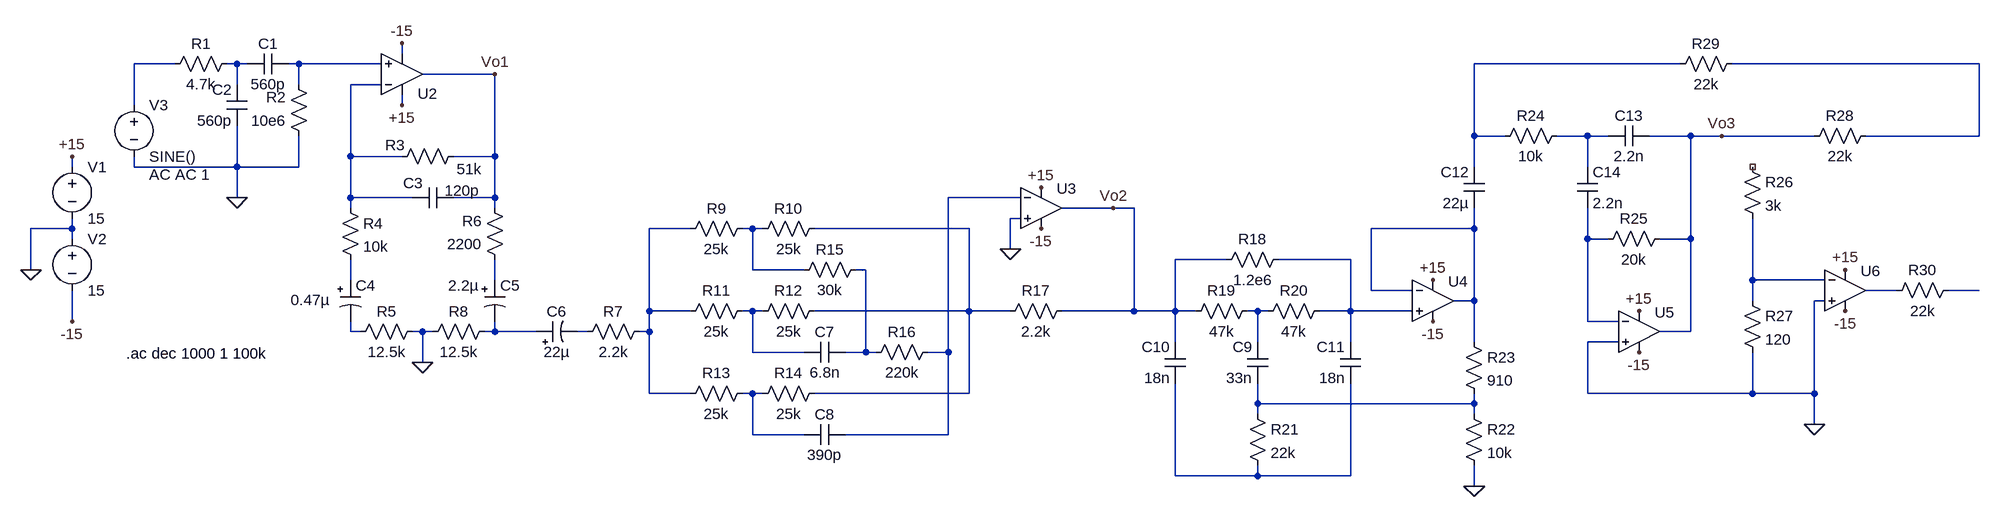
[diagram p0: schematic Amplificador_Jose.asc]
Amplificador_Jose.asc, the LTspice schematic file:
Version 4
SHEET 1 2568 988
WIRE 112 96 112 80
WIRE -240 112 -304 112
WIRE -144 112 -160 112
WIRE -128 112 -144 112
WIRE -48 112 -64 112
WIRE 80 112 -48 112
WIRE 2096 112 1776 112
WIRE 2560 112 2176 112
WIRE 256 128 144 128
WIRE -144 144 -144 112
WIRE -48 144 -48 112
WIRE 80 144 32 144
WIRE -304 176 -304 112
WIRE 112 176 112 160
WIRE 1776 224 1776 112
WIRE 1824 224 1776 224
WIRE 1952 224 1904 224
WIRE 1984 224 1952 224
WIRE 2112 224 2048 224
WIRE 2160 224 2112 224
WIRE 2304 224 2160 224
WIRE 2560 224 2560 112
WIRE 2560 224 2384 224
WIRE 32 256 32 144
WIRE 112 256 32 256
WIRE 256 256 256 128
WIRE 256 256 192 256
WIRE -400 272 -400 256
WIRE -304 272 -304 256
WIRE -144 272 -144 208
WIRE -144 272 -304 272
WIRE -48 272 -48 224
WIRE -48 272 -144 272
WIRE 1776 272 1776 224
WIRE 1952 272 1952 224
WIRE -144 320 -144 272
WIRE 32 320 32 256
WIRE 128 320 32 320
WIRE 256 320 256 256
WIRE 256 320 192 320
WIRE 1072 320 960 320
WIRE 32 336 32 320
WIRE 256 336 256 320
WIRE 1216 336 1136 336
WIRE 1248 336 1216 336
WIRE 1072 352 1056 352
WIRE -400 368 -400 352
WIRE -400 368 -464 368
WIRE 560 368 496 368
WIRE 656 368 640 368
WIRE 672 368 656 368
WIRE 992 368 752 368
WIRE 1776 368 1776 336
WIRE 1776 368 1616 368
WIRE -400 384 -400 368
WIRE 1952 384 1952 336
WIRE 1984 384 1952 384
WIRE 2112 384 2112 224
WIRE 2112 384 2064 384
WIRE 1056 400 1056 352
WIRE 1392 416 1312 416
WIRE 1584 416 1472 416
WIRE -464 432 -464 368
WIRE 656 432 656 368
WIRE 736 432 656 432
WIRE 832 432 816 432
WIRE 32 448 32 416
WIRE 256 448 256 416
WIRE 2208 448 2208 352
WIRE 2320 448 2208 448
WIRE 1616 464 1616 368
WIRE 1680 464 1616 464
WIRE 2432 464 2384 464
WIRE 2560 464 2512 464
WIRE 1776 480 1776 368
WIRE 1776 480 1744 480
WIRE 2208 480 2208 448
WIRE 2320 480 2304 480
WIRE 496 496 496 368
WIRE 560 496 496 496
WIRE 656 496 640 496
WIRE 672 496 656 496
WIRE 992 496 992 368
WIRE 992 496 752 496
WIRE 1056 496 992 496
WIRE 1248 496 1248 336
WIRE 1248 496 1136 496
WIRE 1312 496 1312 416
WIRE 1312 496 1248 496
WIRE 1344 496 1312 496
WIRE 1440 496 1424 496
WIRE 1456 496 1440 496
WIRE 1584 496 1584 416
WIRE 1584 496 1536 496
WIRE 1680 496 1584 496
WIRE -400 512 -400 464
WIRE 1952 512 1952 384
WIRE 2000 512 1952 512
WIRE 32 528 32 512
WIRE 48 528 32 528
WIRE 144 528 128 528
WIRE 160 528 144 528
WIRE 256 528 256 512
WIRE 256 528 240 528
WIRE 320 528 256 528
WIRE 400 528 384 528
WIRE 496 528 496 496
WIRE 496 528 480 528
WIRE 2112 528 2112 384
WIRE 2112 528 2064 528
WIRE 1312 544 1312 496
WIRE 1440 544 1440 496
WIRE 1584 544 1584 496
WIRE 1776 544 1776 480
WIRE 2000 544 1952 544
WIRE 656 560 656 496
WIRE 736 560 656 560
WIRE 832 560 832 432
WIRE 832 560 800 560
WIRE 848 560 832 560
WIRE 960 560 960 320
WIRE 960 560 928 560
WIRE 144 576 144 528
WIRE 496 624 496 528
WIRE 560 624 496 624
WIRE 656 624 640 624
WIRE 672 624 656 624
WIRE 992 624 992 496
WIRE 992 624 752 624
WIRE 1952 624 1952 544
WIRE 2208 624 2208 560
WIRE 2208 624 1952 624
WIRE 2304 624 2304 480
WIRE 2304 624 2208 624
WIRE 1440 640 1440 608
WIRE 1776 640 1776 624
WIRE 1776 640 1440 640
WIRE 1440 656 1440 640
WIRE 1776 656 1776 640
WIRE 2304 672 2304 624
WIRE 656 688 656 624
WIRE 736 688 656 688
WIRE 960 688 960 560
WIRE 960 688 800 688
WIRE 1312 752 1312 608
WIRE 1440 752 1440 736
WIRE 1440 752 1312 752
WIRE 1584 752 1584 608
WIRE 1584 752 1440 752
WIRE 1776 768 1776 736
FLAG 112 176 +15
FLAG -400 256 +15
FLAG -400 512 -15
FLAG 112 80 -15
FLAG -464 432 0
FLAG -144 320 0
FLAG 144 576 0
FLAG 1104 304 +15
FLAG 1104 368 -15
FLAG 1056 400 0
FLAG 256 128 Vo1
FLAG 1216 336 Vo2
FLAG 1712 448 +15
FLAG 1712 512 -15
FLAG 1776 768 0
FLAG 2160 224 Vo3
FLAG 2032 496 +15
FLAG 2032 560 -15
FLAG 2352 432 +15
FLAG 2352 496 -15
FLAG 2304 672 0
SYMBOL voltage -400 256 R0
WINDOW 123 0 0 Left 0
WINDOW 39 0 0 Left 0
SYMATTR InstName V1
SYMATTR Value 15
SYMBOL voltage -400 368 R0
WINDOW 123 0 0 Left 0
WINDOW 39 0 0 Left 0
SYMATTR InstName V2
SYMATTR Value 15
SYMBOL voltage -304 160 R0
WINDOW 123 24 124 Left 2
WINDOW 39 0 0 Left 0
SYMATTR Value2 AC AC 1
SYMATTR InstName V3
SYMATTR Value SINE()
SYMBOL res -144 96 R90
WINDOW 0 0 56 VBottom 2
WINDOW 3 32 56 VTop 2
SYMATTR InstName R1
SYMATTR Value 4.7k
SYMBOL res -32 240 R180
WINDOW 0 36 76 Left 2
WINDOW 3 36 40 Left 2
SYMATTR InstName R2
SYMATTR Value 10e6
SYMBOL res 96 272 R270
WINDOW 0 18 5 VTop 2
WINDOW 3 12 120 VBottom 2
SYMATTR InstName R3
SYMATTR Value 51k
SYMBOL res 16 320 R0
SYMATTR InstName R4
SYMATTR Value 10k
SYMBOL res 272 432 R180
WINDOW 0 36 76 Left 2
WINDOW 3 36 40 Left 2
SYMATTR InstName R6
SYMATTR Value 2200
SYMBOL res 384 544 R270
WINDOW 0 32 56 VTop 2
WINDOW 3 0 56 VBottom 2
SYMATTR InstName R7
SYMATTR Value 2.2k
SYMBOL cap -64 96 R90
WINDOW 0 0 32 VBottom 2
WINDOW 3 32 32 VTop 2
SYMATTR InstName C1
SYMATTR Value 560p
SYMBOL cap -128 208 R180
WINDOW 0 24 56 Left 2
WINDOW 3 24 8 Left 2
SYMATTR InstName C2
SYMATTR Value 560p
SYMBOL cap 128 336 R270
WINDOW 0 23 1 VTop 2
WINDOW 3 43 77 VBottom 2
SYMATTR InstName C3
SYMATTR Value 120p
SYMBOL polcap 16 448 R0
WINDOW 3 -77 31 Left 2
SYMATTR InstName C4
SYMATTR Value 0.47µ
SYMBOL polcap 240 448 R0
WINDOW 3 -56 8 Left 2
SYMATTR InstName C5
SYMATTR Value 2.2µ
SYMBOL polcap 320 544 R270
WINDOW 0 32 32 VTop 2
WINDOW 3 0 32 VBottom 2
SYMATTR InstName C6
SYMATTR Value 22µ
SYMBOL OpAmps\\UniversalOpamp2 112 128 M180
WINDOW 0 24 -30 Left 2
SYMATTR InstName U2
SYMBOL res 144 512 R90
WINDOW 0 0 56 VBottom 2
WINDOW 3 32 56 VTop 2
SYMATTR InstName R5
SYMATTR Value 12.5k
SYMBOL res 256 512 R90
WINDOW 0 0 56 VBottom 2
WINDOW 3 32 56 VTop 2
SYMATTR InstName R8
SYMATTR Value 12.5k
SYMBOL res 656 352 R90
WINDOW 0 0 56 VBottom 2
WINDOW 3 32 56 VTop 2
SYMATTR InstName R9
SYMATTR Value 25k
SYMBOL res 768 352 R90
WINDOW 0 0 56 VBottom 2
WINDOW 3 32 56 VTop 2
SYMATTR InstName R10
SYMATTR Value 25k
SYMBOL res 656 480 R90
WINDOW 0 0 56 VBottom 2
WINDOW 3 32 56 VTop 2
SYMATTR InstName R11
SYMATTR Value 25k
SYMBOL res 768 480 R90
WINDOW 0 0 56 VBottom 2
WINDOW 3 32 56 VTop 2
SYMATTR InstName R12
SYMATTR Value 25k
SYMBOL res 656 608 R90
WINDOW 0 0 56 VBottom 2
WINDOW 3 32 56 VTop 2
SYMATTR InstName R13
SYMATTR Value 25k
SYMBOL res 768 608 R90
WINDOW 0 0 56 VBottom 2
WINDOW 3 32 56 VTop 2
SYMATTR InstName R14
SYMATTR Value 25k
SYMBOL cap 800 544 R90
WINDOW 0 0 32 VBottom 2
WINDOW 3 32 32 VTop 2
SYMATTR InstName C7
SYMATTR Value 6.8n
SYMBOL cap 800 672 R90
WINDOW 0 0 32 VBottom 2
WINDOW 3 32 32 VTop 2
SYMATTR InstName C8
SYMATTR Value 390p
SYMBOL res 832 416 R90
WINDOW 0 0 56 VBottom 2
WINDOW 3 32 56 VTop 2
SYMATTR InstName R15
SYMATTR Value 30k
SYMBOL res 944 544 R90
WINDOW 0 0 56 VBottom 2
WINDOW 3 32 56 VTop 2
SYMATTR InstName R16
SYMATTR Value 220k
SYMBOL OpAmps\\UniversalOpamp2 1104 336 R0
WINDOW 0 24 -30 Left 2
SYMATTR InstName U3
SYMBOL res 1152 480 R90
WINDOW 0 0 56 VBottom 2
WINDOW 3 32 56 VTop 2
SYMATTR InstName R17
SYMATTR Value 2.2k
SYMBOL res 1488 400 R90
WINDOW 0 0 56 VBottom 2
WINDOW 3 32 56 VTop 2
SYMATTR InstName R18
SYMATTR Value 1.2e6
SYMBOL res 1328 512 R270
WINDOW 0 32 56 VTop 2
WINDOW 3 0 56 VBottom 2
SYMATTR InstName R19
SYMATTR Value 47k
SYMBOL res 1440 512 R270
WINDOW 0 32 56 VTop 2
WINDOW 3 0 56 VBottom 2
SYMATTR InstName R20
SYMATTR Value 47k
SYMBOL res 1424 640 R0
SYMATTR InstName R21
SYMATTR Value 22k
SYMBOL cap 1456 608 R180
WINDOW 0 24 56 Left 2
WINDOW 3 24 8 Left 2
SYMATTR InstName C9
SYMATTR Value 33n
SYMBOL cap 1328 608 R180
WINDOW 0 24 56 Left 2
WINDOW 3 24 8 Left 2
SYMATTR InstName C10
SYMATTR Value 18n
SYMBOL cap 1600 608 R180
WINDOW 0 24 56 Left 2
WINDOW 3 24 8 Left 2
SYMATTR InstName C11
SYMATTR Value 18n
SYMBOL OpAmps\\UniversalOpamp2 1712 480 R0
WINDOW 0 24 -30 Left 2
SYMATTR InstName U4
SYMBOL res 1760 640 R0
SYMATTR InstName R22
SYMATTR Value 10k
SYMBOL res 1760 528 R0
SYMATTR InstName R23
SYMATTR Value 910
SYMBOL cap 1792 336 R180
WINDOW 0 24 56 Left 2
WINDOW 3 24 8 Left 2
SYMATTR InstName C12
SYMATTR Value 22µ
SYMBOL res 1920 208 R90
WINDOW 0 0 56 VBottom 2
WINDOW 3 32 56 VTop 2
SYMATTR InstName R24
SYMATTR Value 10k
SYMBOL cap 1984 240 R270
WINDOW 0 32 32 VTop 2
WINDOW 3 0 32 VBottom 2
SYMATTR InstName C13
SYMATTR Value 2.2n
SYMBOL cap 1936 272 R0
SYMATTR InstName C14
SYMATTR Value 2.2n
SYMBOL res 2080 368 R90
WINDOW 0 0 56 VBottom 2
WINDOW 3 32 56 VTop 2
SYMATTR InstName R25
SYMATTR Value 20k
SYMBOL OpAmps\\UniversalOpamp2 2032 528 R0
WINDOW 0 24 -30 Left 2
SYMATTR InstName U5
SYMBOL res 2192 256 R0
SYMATTR InstName R26
SYMATTR Value 3k
SYMBOL res 2192 464 R0
SYMATTR InstName R27
SYMATTR Value 120
SYMBOL OpAmps\\UniversalOpamp2 2352 464 R0
WINDOW 0 24 -30 Left 2
SYMATTR InstName U6
SYMBOL res 2400 208 R90
WINDOW 0 0 56 VBottom 2
WINDOW 3 32 56 VTop 2
SYMATTR InstName R28
SYMATTR Value 22k
SYMBOL res 2192 96 R90
WINDOW 0 0 56 VBottom 2
WINDOW 3 32 56 VTop 2
SYMATTR InstName R29
SYMATTR Value 22k
SYMBOL res 2528 448 R90
WINDOW 0 0 56 VBottom 2
WINDOW 3 32 56 VTop 2
SYMATTR InstName R30
SYMATTR Value 22k
TEXT -316 562 Left 2 !.ac dec 1000 1 100k

The netlist it stands for:
* Amplificador_Jose.asc
V1 +15 0 15
V2 0 -15 15
V3 N001 0 SINE() AC AC 1
R1 N002 N001 4.7k
R2 0 N003 10e6
R3 N006 Vo1 51k
R4 N006 N016 10k
R6 N017 Vo1 2200
R7 N025 N009 2.2k
C1 N003 N002 560p
C2 0 N002 560p
C3 N006 Vo1 120p
C4 N016 N023 0.47µ
C5 N017 N024 2.2µ
C6 N024 N025 22µ
XU2 N003 N006 +15 -15 Vo1 level.2 Avol=1Meg GBW=10Meg Slew=10Meg ilimit=25m rail=0 Vos=0 phimargin=45 en=0 enk=0 in=0 ink=0 Rin=500Meg  ; pins IN+ IN- V+ V- OUT
R5 0 N023 12.5k
R8 N024 0 12.5k
R9 N010 N009 25k
R10 N011 N010 25k
R11 N021 N009 25k
R12 N011 N021 25k
R13 N026 N009 25k
R14 N011 N026 25k
C7 N015 N021 6.8n
C8 N008 N026 390p
R15 N015 N010 30k
R16 N008 N015 220k
XU3 0 N008 +15 -15 Vo2 level.2 Avol=1Meg GBW=10Meg Slew=10Meg ilimit=25m rail=0 Vos=0 phimargin=45 en=0 enk=0 in=0 ink=0 Rin=500Meg  ; pins IN+ IN- V+ V- OUT
R17 Vo2 N011 2.2k
R18 N014 Vo2 1.2e6
R19 Vo2 N022 47k
R20 N022 N014 47k
R21 N027 N028 22k
C9 N027 N022 33n
C10 N028 Vo2 18n
C11 N028 N014 18n
XU4 N014 N012 +15 -15 N012 level.2 Avol=1Meg GBW=10Meg Slew=10Meg ilimit=25m rail=0 Vos=0 phimargin=45 en=0 enk=0 in=0 ink=0 Rin=500Meg  ; pins IN+ IN- V+ V- OUT
R22 N027 0 10k
R23 N012 N027 910
C12 N012 N004 22µ
R24 N007 N004 10k
C13 N007 Vo3 2.2n
C14 N007 N013 2.2n
R25 Vo3 N013 20k
XU5 0 N013 +15 -15 Vo3 level.2 Avol=1Meg GBW=10Meg Slew=10Meg ilimit=25m rail=0 Vos=0 phimargin=45 en=0 enk=0 in=0 ink=0 Rin=500Meg  ; pins IN+ IN- V+ V- OUT
R26 NC_01 N018 3k
R27 N018 0 120
XU6 0 N018 +15 -15 N019 level.2 Avol=1Meg GBW=10Meg Slew=10Meg ilimit=25m rail=0 Vos=0 phimargin=45 en=0 enk=0 in=0 ink=0 Rin=500Meg  ; pins IN+ IN- V+ V- OUT
R28 N005 Vo3 22k
R29 N005 N004 22k
R30 N020 N019 22k
.ac dec 1000 1 100k
.lib UniversalOpamps2.sub
.backanno
.end

* Results of the author's LTspice run, read from the files saved beside the schematic
* Operating Point, zero values left out:
*   V(+15) = 15 V
*   V(-15) = -15 V
*   I(V2) = -7.492 mA
*   I(V1) = -7.492 mA